# EAGLE schematic cryologger_itb_v1 (EAGLE 9.2.2)

## Sheet 1 of 3
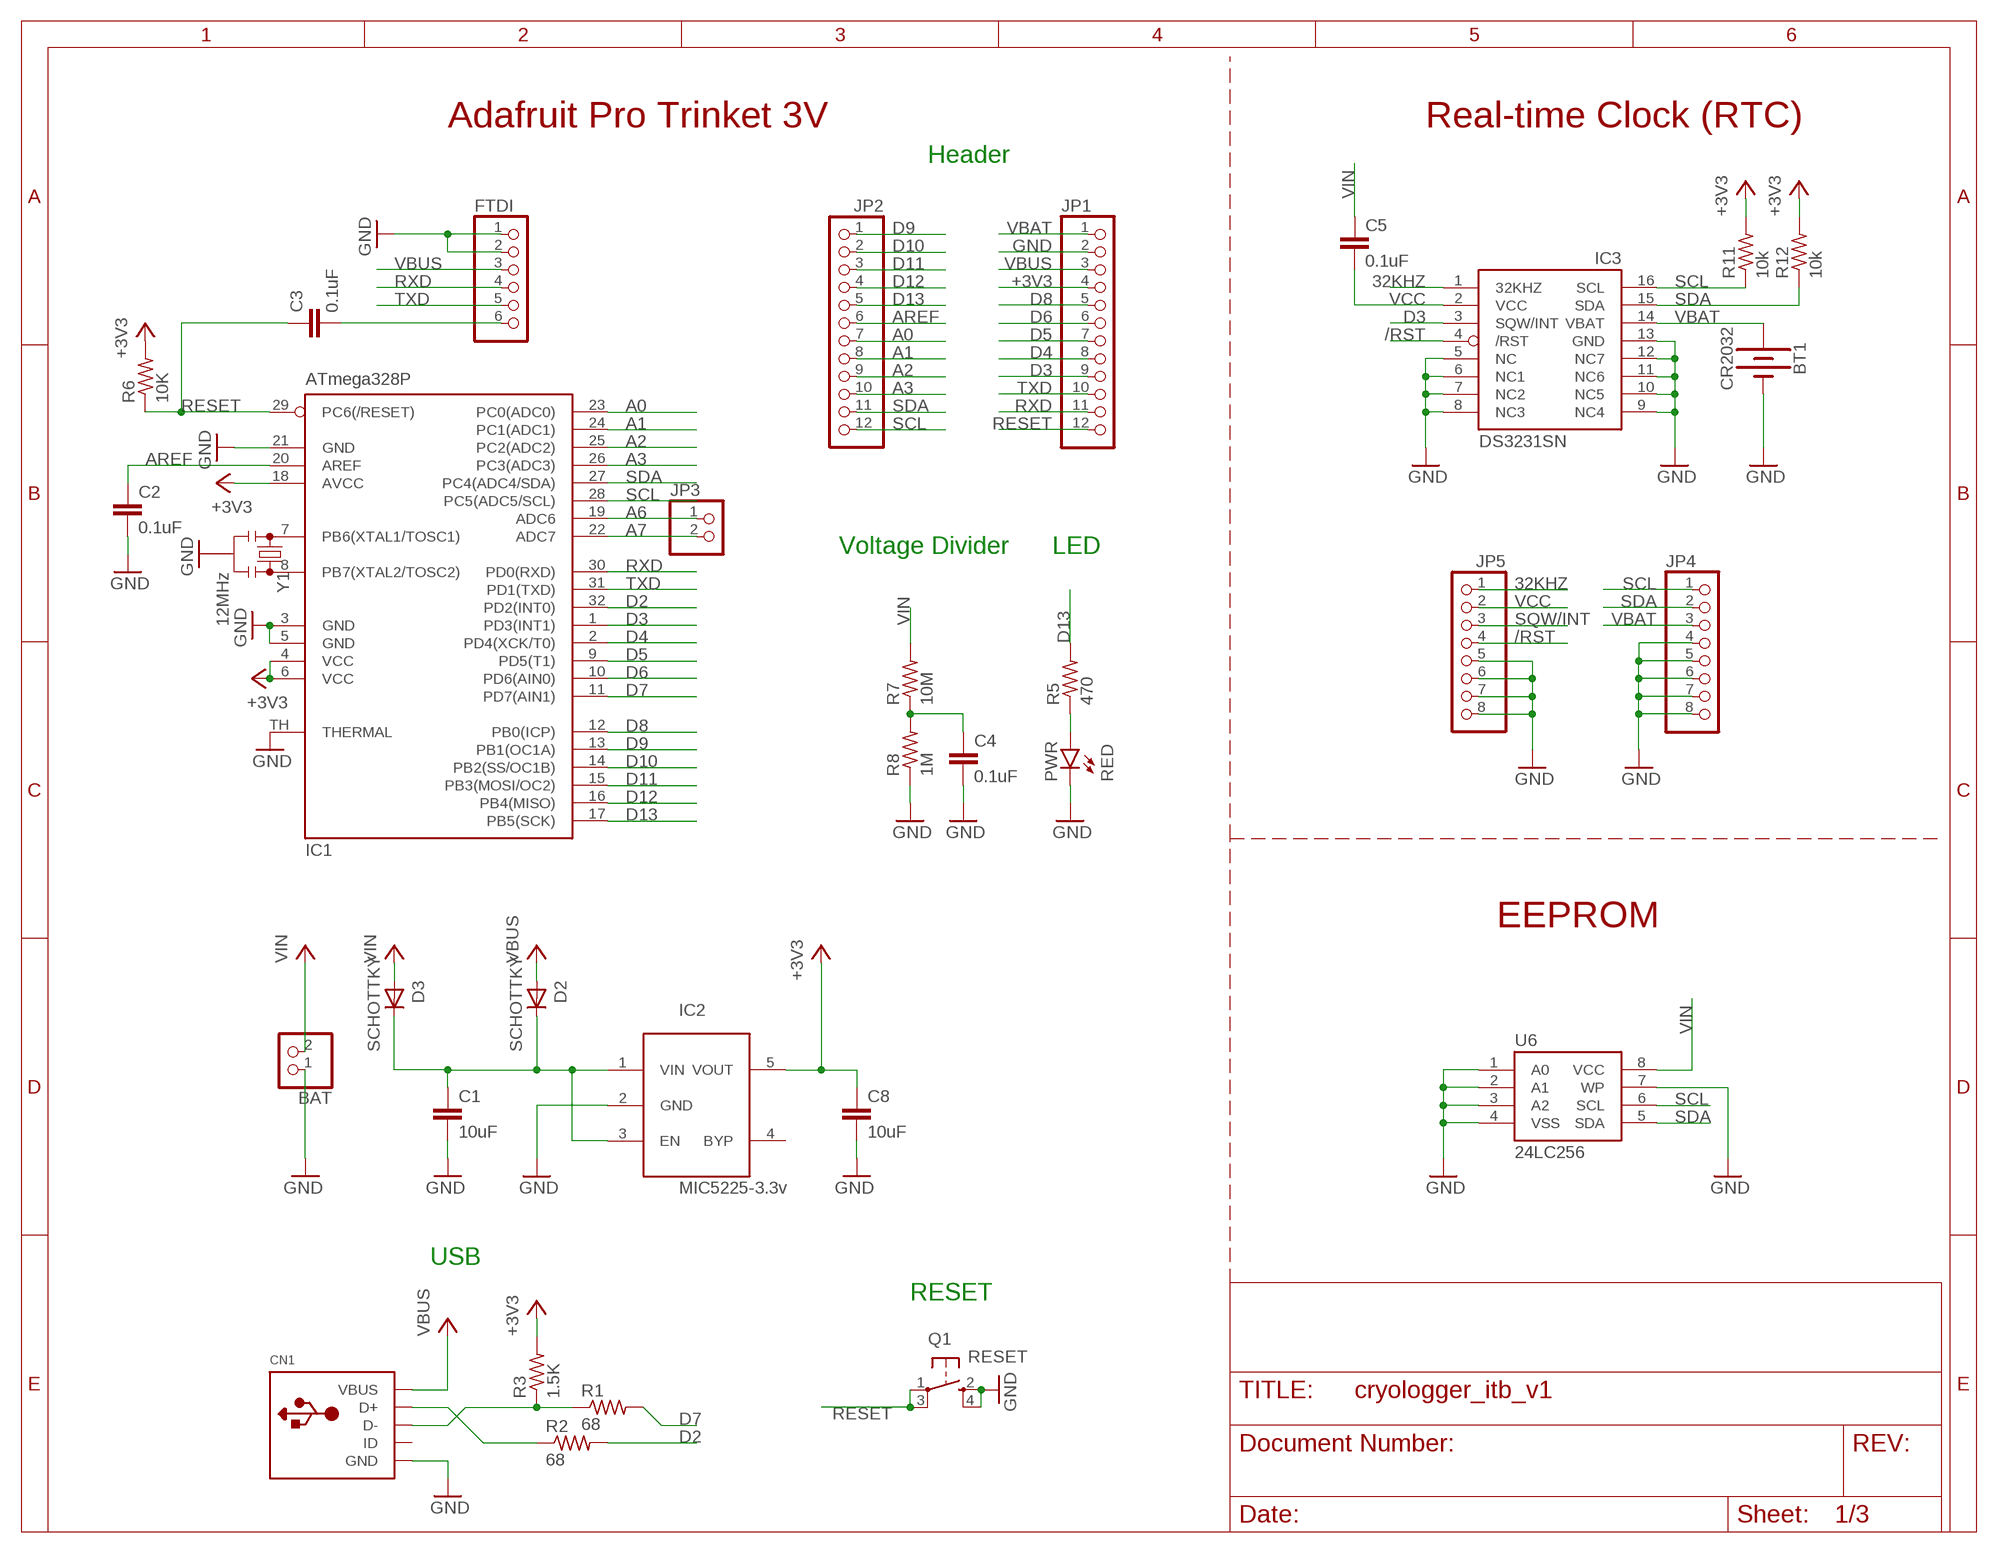
[diagram p0: schematic, sheet 1]

### Parts
BAT  PINHD-1X2  [1X02]
BT1  CR2032  BATTERY-20MM_SMD  [BATTCON_20MM]
C1  10uF  C-EUC0805  [C0805]
C2  0.1uF  C-EUC0805  [C0805]
C3  0.1uF  C-EUC0805  [C0805]
C4  0.1uF  C-EU025-024X044  [C025-024X044]
C5  0.1uF  C-EU025-024X044  [C025-024X044]
C8  10uF  C-EUC0805  [C0805]
CN1  USBMICRO_20329  [4UCONN_20329]
D2  SCHOTTKY  DIODE_SOD-123FL  [SOD-123FL]
D3  SCHOTTKY  DIODE_SOD-123FL  [SOD-123FL]
FTDI  PINHD-1X6  [1X06]
IC1  ATmega328P  MEGA8-MI  [MLF32-TH]
IC2  MIC5225-3.3v  LP298XS  [SOT23-5L]
IC3  DS3231SN  DS3231/SO  [SO16W]
JP1  PINHD-1X12  [1X12]
JP2  PINHD-1X12  [1X12]
JP3  PINHD-1X2  [1X02]
JP4  PINHD-1X8  [1X08]
JP5  PINHD-1X8  [1X08]
PWR  RED  LEDSML0805  [SML0805]
Q1  RESET  SPST_TACT-KMR2  [KMR2]
R1  68  R-US_R0603  [R0603]
R2  68  R-US_R0603  [R0603]
R3  1.5K  R-US_R0603  [R0603]
R5  470  R-US_R0603  [R0603]
R6  10K  R-US_R0603  [R0603]
R7  10M  R-US_0207/10  [0207/10]
R8  1M  R-US_0207/10  [0207/10]
R11  10k  R-US_0207/7  [0207/7]
R12  10k  R-US_0207/7  [0207/7]
U6  24LC256  EEPROM-I2CSMD  [SO08]
Y1  12MHz  RESONATOR-8MHZSMD_3.2X1.3  [RESONATOR-SMD-3.2X1.3]

### Nets
32KHZ: IC3.1(32KHZ) JP5.1
+3V3 [power]: C8.1 IC1.4(VCC) IC1.6(VCC) IC1.18(AVCC) IC2.5(VOUT) JP1.4 R3.2 R6.2 R11.2 R12.2 ; also sheet 2
/RST: IC3.4(/RST) JP5.4
A0: IC1.23(PC0(ADC0)) JP2.7
A1: IC1.24(PC1(ADC1)) JP2.8
A2: IC1.25(PC2(ADC2)) JP2.9
A3: IC1.26(PC3(ADC3)) JP2.10
A6: IC1.19(ADC6) JP3.1
A7: IC1.22(ADC7) JP3.2
AREF: C2.1 IC1.20(AREF) JP2.6
D2: IC1.32(PD2(INT0)) R2.2
D3: IC1.1(PD3(INT1)) IC3.3(SQW/INT) JP1.9
D4: IC1.2(PD4(XCK/T0)) JP1.8
D5: IC1.9(PD5(T1)) JP1.7
D6: IC1.10(PD6(AIN0)) JP1.6
D7: IC1.11(PD7(AIN1)) R1.2
D8: IC1.12(PB0(ICP)) JP1.5
D9: IC1.13(PB1(OC1A)) JP2.1
D10: IC1.14(PB2(SS/OC1B)) JP2.2
D11: IC1.15(PB3(MOSI/OC2)) JP2.3
D12: IC1.16(PB4(MISO)) JP2.4
D13: IC1.17(PB5(SCK)) JP2.5 R5.2
D+: CN1.D+ R2.1
D-: CN1.D- R1.1 R3.1
DTR/RTS: C3.2 FTDI.6
GND [power]: BAT.1 BT1.2(-) C1.2 C2.2 C4.2 C8.2 CN1.BASE@1(GND) CN1.BASE@2(GND) CN1.GND CN1.SPRT@1(GND) CN1.SPRT@2(GND) CN1.SPRT@3(GND) CN1.SPRT@4(GND) FTDI.1 FTDI.2 IC1.3(GND) IC1.5(GND) IC1.21(GND) IC1.TH(THERMAL) IC2.2(GND) IC3.5(NC) IC3.6(NC1) IC3.7(NC2) IC3.8(NC3) IC3.9(NC4) IC3.10(NC5) IC3.11(NC6) IC3.12(NC7) IC3.13(GND) JP1.2 JP4.4 JP4.5 JP4.6 JP4.7 JP4.8 JP5.5 JP5.6 JP5.7 JP5.8 PWR.C Q1.2(S) Q1.4(S1) R8.1 U6.1(A0) U6.2(A1) U6.3(A2) U6.4(VSS) U6.7(WP) Y1.2 ; also sheet 2,3
N$1: PWR.A R5.1
N$2: IC1.8(PB7(XTAL2/TOSC2)) Y1.3
N$3: IC1.7(PB6(XTAL1/TOSC1)) Y1.1 ; also sheet 2
N$4: C1.1 D2.C D3.C IC2.1(VIN) IC2.3(EN)
N$5: C4.1 R7.1 R8.2
RESET: C3.1 IC1.29(PC6(/RESET)) JP1.12 Q1.1(P) Q1.3(P1) R6.1
RXD: FTDI.4 IC1.30(PD0(RXD)) JP1.11
SCL: IC1.28(PC5(ADC5/SCL)) IC3.16(SCL) JP2.12 JP4.1 R11.1 U6.6(SCL) ; also sheet 2
SDA: IC1.27(PC4(ADC4/SDA)) IC3.15(SDA) JP2.11 JP4.2 R12.1 U6.5(SDA) ; also sheet 2
SQW/INT: JP5.3
TXD: FTDI.5 IC1.31(PD1(TXD)) JP1.10
VBAT [power]: BAT.2 BT1.1(+) D3.A IC3.14(VBAT) JP1.1 JP4.3 ; supply symbol labelled VIN
VBUS [power]: D2.A FTDI.3 JP1.3
VCC: C5.2 CN1.VBUS IC3.2(VCC) JP5.2 ; supply symbol labelled VBUS
VIN: C5.1 R7.2 U6.8(VCC) ; also sheet 2
Unconnected: CN1.ID IC2.4(BYP)

### Notes on the sheet
- Adafruit Pro Trinket 3V | Real-time Clock (RTC)
- Header
- Voltage Divider | LED
- EEPROM
- USB
- RESET

## Sheet 2 of 3
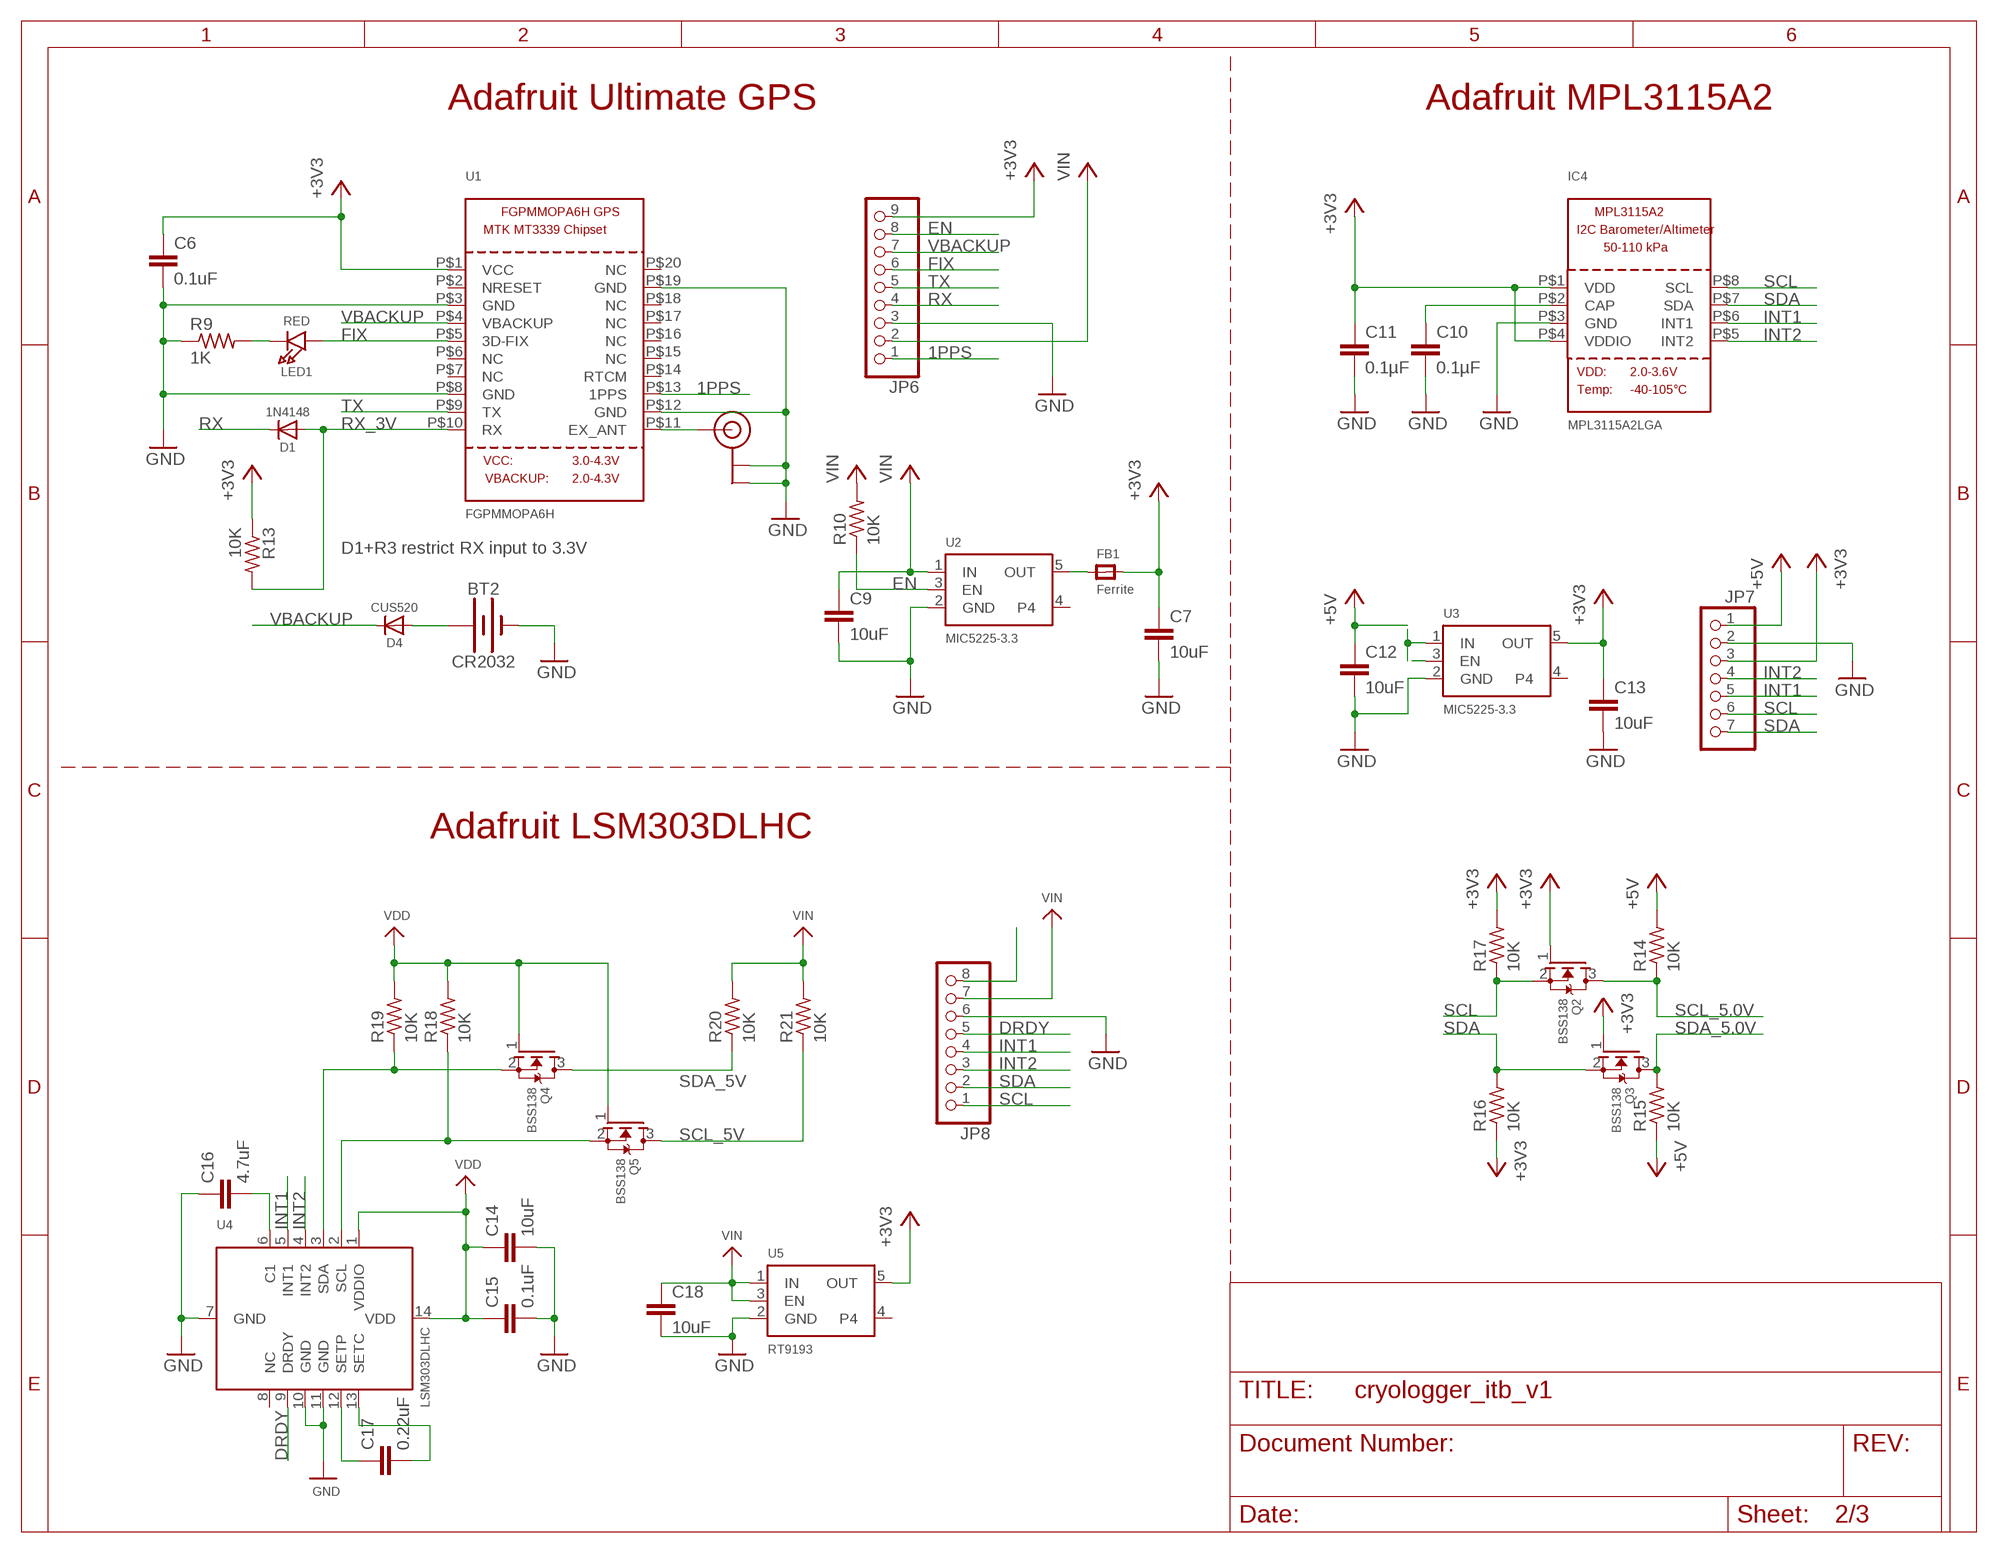
[diagram p1: schematic, sheet 2]

### Parts
BT2  CR2032  BATTERY-20MM_SMD  [BATTCON_20MM]
C6  0.1uF  C-EUC0805  [C0805]
C7  10uF  C-EUC0805  [C0805]
C9  10uF  C-EUC0805  [C0805]
C10  0.1µF  C-EUC0805  [C0805]
C11  0.1µF  C-EUC0805  [C0805]
C12  10uF  C-EUC0805  [C0805]
C13  10uF  C-EUC0805  [C0805]
C14  10uF  C-EUC0805  [C0805]
C15  0.1uF  C-EUC0805  [C0805]
C16  4.7uF  C-EUC0805  [C0805]
C17  0.22uF  C-EUC0805  [C0805]
C18  10uF  C-EUC0805  [C0805]
D1  1N4148  DIODESOD-323  [SOD-323]
D4  CUS520  DIODESOD-323  [SOD-323]
FB1  Ferrite  FERRITE-0805NO  [0805-NO@1]
IC4  MPL3115A2LGA  [LGA8]
JP6  HEADER-1X970MIL  [1X09_ROUND_70]
JP7  HEADER-1X770MIL  [1X07_ROUND_70]
JP8  HEADER-1X876MIL  [1X08_ROUND_76]
LED1  RED  LED0805  [CHIPLED_0805]
Q2  BSS138  MOSFET-NWIDE  [SOT23-WIDE]
Q3  BSS138  MOSFET-NWIDE  [SOT23-WIDE]
Q4  BSS138  MOSFET-NWIDE  [SOT23-WIDE]
Q5  BSS138  MOSFET-NWIDE  [SOT23-WIDE]
R9  1K  R-US_R0805  [R0805]
R10  10K  R-US_R0805  [R0805]
R13  10K  R-US_R0805  [R0805]
R14  10K  R-US_R0805  [R0805]
R15  10K  R-US_R0805  [R0805]
R16  10K  R-US_R0805  [R0805]
R17  10K  R-US_R0805  [R0805]
R18  10K  R-US_R0805  [R0805]
R19  10K  R-US_R0805  [R0805]
R20  10K  R-US_R0805  [R0805]
R21  10K  R-US_R0805  [R0805]
U1  FGPMMOPA6H  GPS_FGPMMOPA6H  [FGPMMOPA6H]
U2  MIC5225-3.3  VREG_SOT23-5  [SOT23-5]
U3  MIC5225-3.3  VREG_SOT23-5  [SOT23-5]
U4  LSM303DLHC  [LGA14]
U5  RT9193  VREG_SOT23-5  [SOT23-5]
U$20  U.FL  [U.FL]

### Nets
1PPS: JP6.1 U1.P$13(1PPS)
3.3V: C6.1 JP6.9 R13.1 U1.P$1(VCC) ; supply symbol labelled +3V3
+3V3 [power]: C7.1 C11.1 C13.1 FB1.2 IC4.P$1(VDD) IC4.P$4(VDDIO) JP7.3 Q2.1(G) Q3.1(G) R16.1 R17.2 U3.5(OUT) ; also sheet 1
+5V: C12.1 JP7.1 R14.2 R15.1 U3.1(IN) U3.3(EN)
DRDY: JP8.5 U4.9(DRDY)
EN: JP6.8 R10.1 U2.3(EN)
FIX: JP6.6 LED1.A U1.P$5(3D-FIX)
GND [power]: BT2.2(-) C6.2 C7.2 C9.2 C10.2 C11.2 C12.2 C13.2 C14.2 C15.2 C16.1 C18.2 IC4.P$3(GND) JP6.3 JP7.2 JP8.6 R9.1 U1.P$3(GND) U1.P$8(GND) U1.P$12(GND) U1.P$19(GND) U2.2(GND) U3.2(GND) U4.7(GND) U4.10(GND) U4.11(GND) U5.2(GND) U$20.P$1(GND) U$20.P$2(GND) ; also sheet 1,3
INT1: IC4.P$6(INT1) JP7.5 JP8.4 U4.5(INT1)
INT2: IC4.P$5(INT2) JP7.4 JP8.3 U4.4(INT2)
N$3: FB1.1 U2.5(OUT) ; also sheet 1
N$7: LED1.C R9.2
N$8: U1.P$11(EX_ANT) U$20.P$3(SIGNAL)
N$9: BT2.1(+) D4.A
N$10: C10.1 IC4.P$2(CAP)
N$11: C16.2 U4.6(C1)
N$12: C17.1 U4.12(SETP)
N$13: C17.2 U4.13(SETC)
N$14: Q4.2(S) R19.1 U4.3(SDA)
N$15: Q5.2(S) R18.1 U4.2(SCL)
RX: D1.C JP6.4
RX_3V: D1.A R13.2 U1.P$10(RX)
SCL: IC4.P$8(SCL) JP7.6 JP8.1 Q2.2(S) R17.1 ; also sheet 1
SCL_5.0V: Q2.3(D) R14.1
SCL_5V: Q5.3(D) R21.1
SDA: IC4.P$7(SDA) JP7.7 JP8.2 Q3.2(S) R16.2 ; also sheet 1
SDA_5.0V: Q3.3(D) R15.2
SDA_5V: Q4.3(D) R20.1
TX: JP6.5 U1.P$9(TX)
VBACKUP: D4.C JP6.7 U1.P$4(VBACKUP)
VDD: C14.1 C15.1 JP8.8 Q4.1(G) Q5.1(G) R18.2 R19.2 U4.1(VDDIO) U4.14(VDD) U5.5(OUT) ; supply symbol labelled +3V3
VIN: C9.1 C18.1 JP6.2 JP8.7 R10.2 R20.2 R21.2 U2.1(IN) U5.1(IN) U5.3(EN) ; also sheet 1
Unconnected: U1.P$2(NRESET) U1.P$6(NC) U1.P$7(NC) U1.P$14(RTCM) U1.P$15(NC) U1.P$16(NC) U1.P$17(NC) U1.P$18(NC) U1.P$20(NC) U2.4 U3.4 U4.8(NC) U5.4

### Notes on the sheet
- Adafruit Ultimate GPS | Adafruit MPL3115A2
- D1+R3 restrict RX input to 3.3V
- Adafruit LSM303DLHC

## Sheet 3 of 3
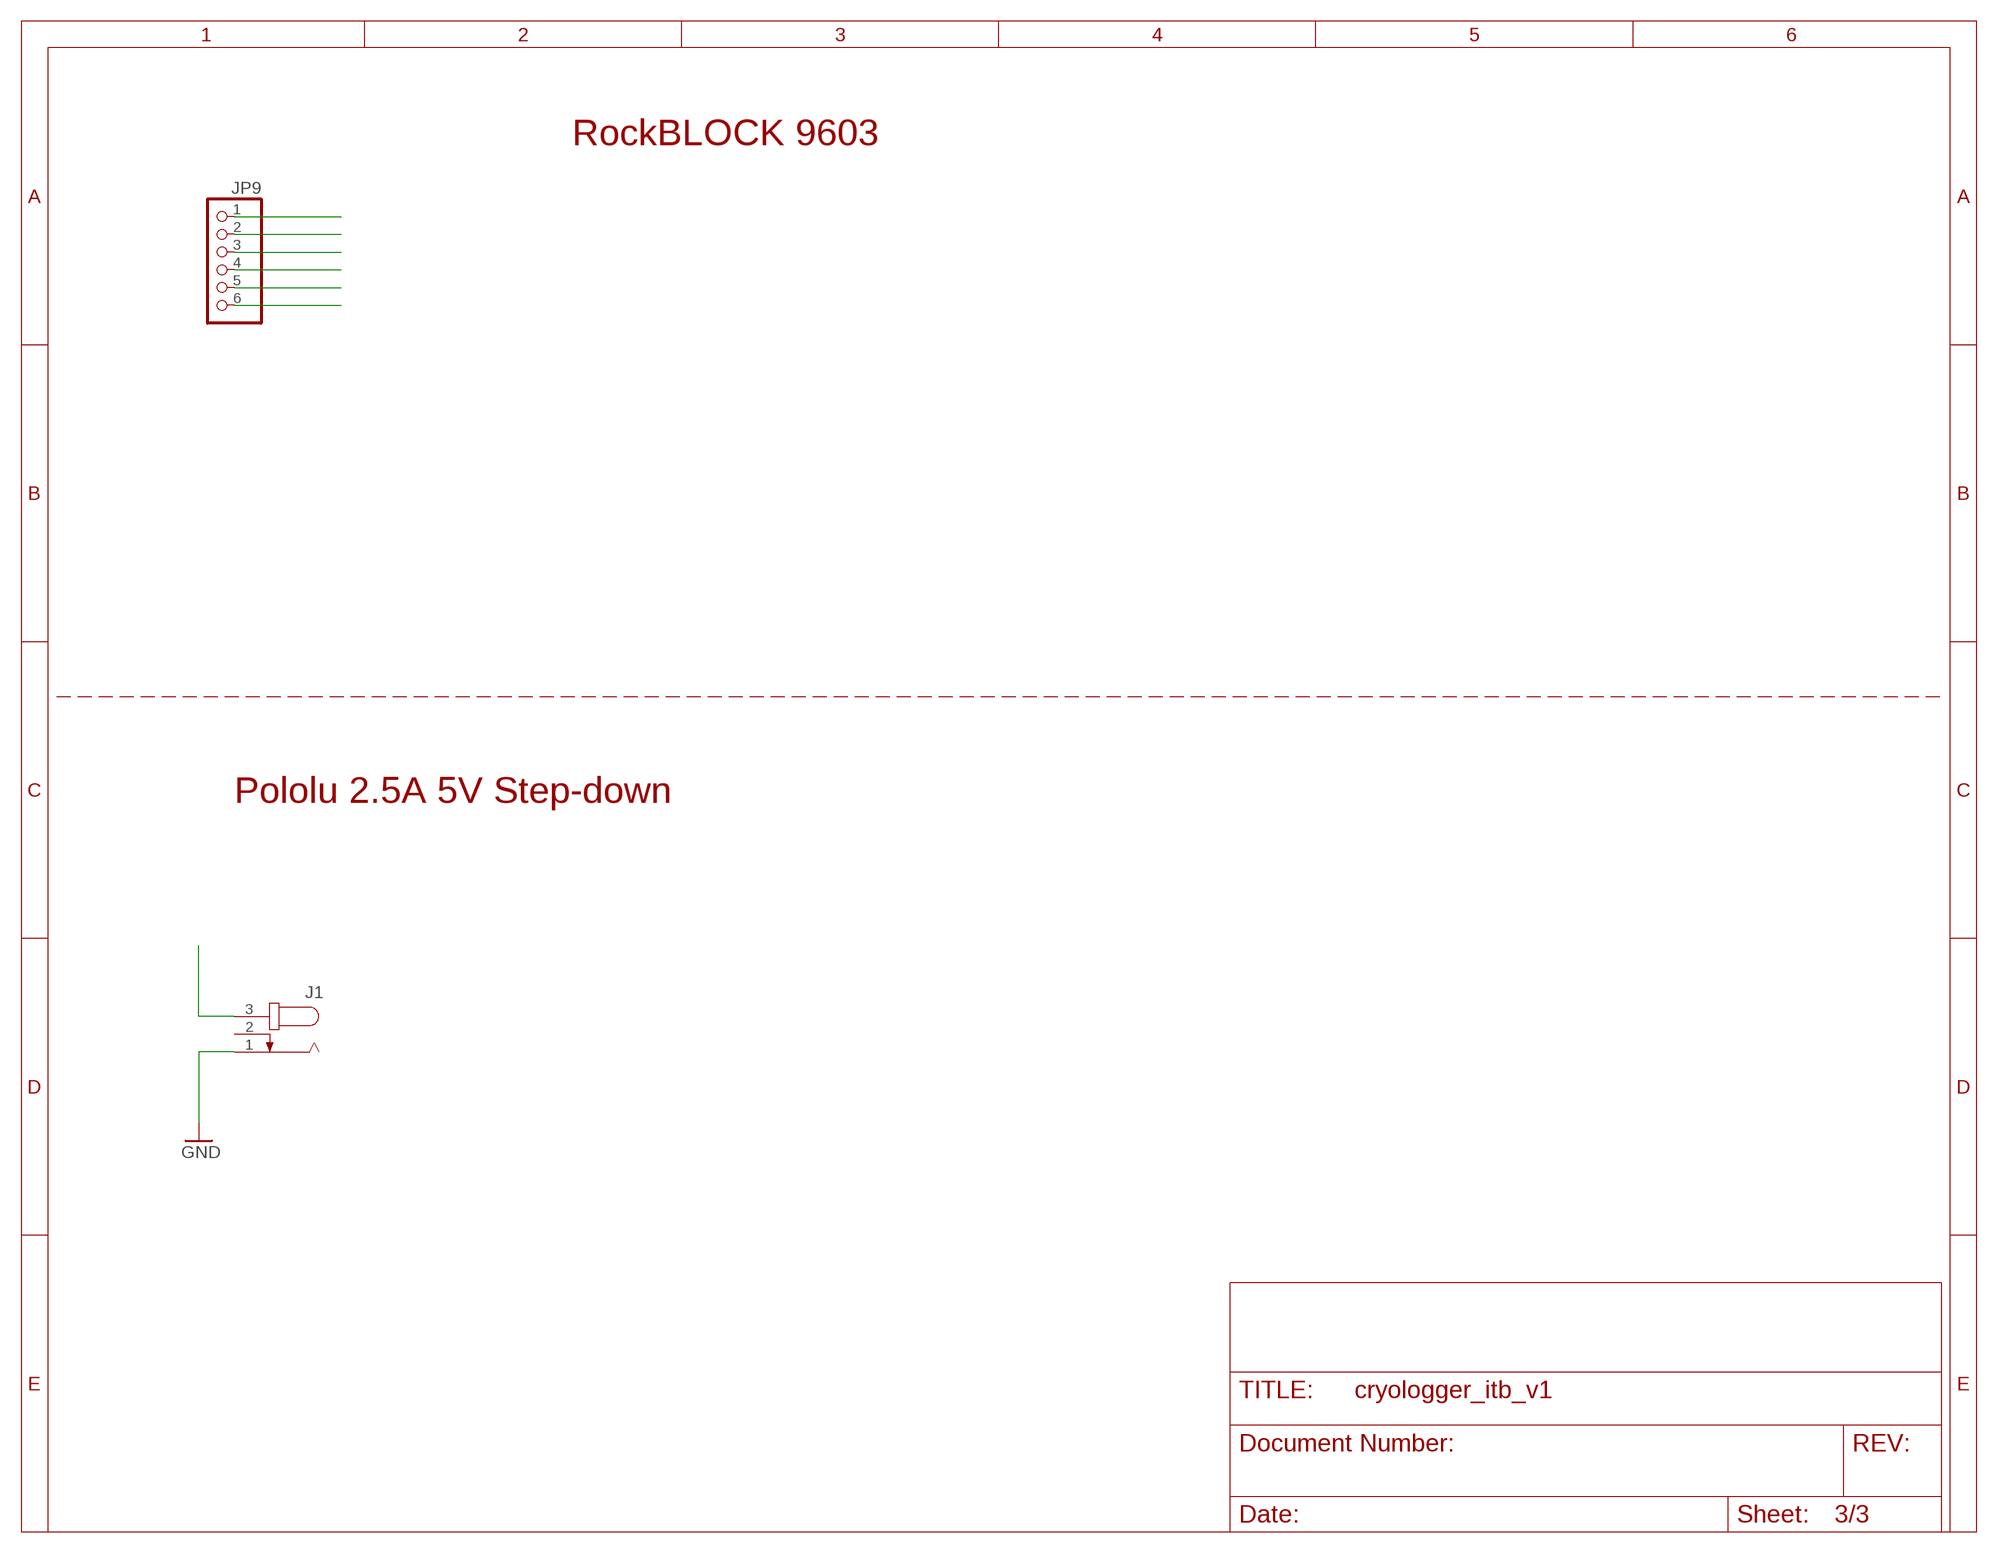
[diagram p2: schematic, sheet 3]

### Parts
J1  JACK-PLUG0  [SPC4077]
JP9  PINHD-1X6  [1X06]

### Nets
GND [power]: J1.1 ; also sheet 1,2
N$6: JP9.1
N$16: JP9.2
N$17: JP9.3
N$18: JP9.4
N$19: JP9.5
N$20: JP9.6
N$22: J1.3
Unconnected: J1.2

### Notes on the sheet
- RockBLOCK 9603
- Pololu 2.5A 5V Step-down

## Library data of the parts
BAT JP3 = pinhead:PINHD-1X2: PIN HEADER
BT1 BT2 = SparkFun-Batteries:BATTERY: Battery - Single Cell A variety of battery chemistries, sizes, and footprints. Device List: 20MM_PTH - Coin Cell Battery Holder - 20mm (PTH) <https://www.sparkfun.com/products/783> 6.8MM_PTH - Coin Cell Battery Holder - 6.8MM(SMD) <https://www.digikey.com/product-detail/en/seiko-instruments/MS621FE-FL11E/728-1057-ND/1889208?WT.srch=1&gclid=CNOQ5a6LzdQCFZS2wAodXCkE0g> 12MM_SMD - Coin Cell Battery Holder - 12mm (SMD) <https://www.sparkfun.com/products/10592> 12MM_PTH - Coin Cell Battery Holder - 12mm (PTH) <https://www.sparkfun.com/products/7948> 20MM_SMD - 20mm Coin Cell Battery Holder (SMD) (2 legs) Used on the Big Time Watch Kit <https://www.sparkfun.com/products/11734> 20MM_SMD_4LEGS - Coin Cell Battery Holder - 20mm (SMD) <https://www.sparkfun.com/products/11892> 20MM_SMD_4LEGS_OVERPASTE - Coin Cell Battery Holder - 20mm (SMD) <https://www.sparkfun.com/products/11892> (Over-paste on the legs) 24.5MM_PTH - Coin Cell Battery Holder - 24.5mm (PTH) <https://www.sparkfun.com/products/8863> 9V - 9V Battery Holder - PC Mount Used on the SparkFun SparkPunk Sound Kit <https://www.sparkfun.com/products/11177> and SparkFun SparkPunk Sequencer Kit <https://www.sparkfun.com/products/12707> 18650 - Battery Holder - 18650 (PTH) <https://www.sparkfun.com/products/13113> AA - Battery Holder - 1xAA (PTH) <https://www.sparkfun.com/products/7949> AAA - Battery Holder - 1xAAA (PTH) <https://www.sparkfun.com/products/12718> AA_KIT - Battery Holder - 1xAA (PTH) <https://www.sparkfun.com/products/7949> Special kit package - pads only have exposed copper on one side of the board. AAA_KIT - Battery Holder - 1xAAA (PTH) <https://www.sparkfun.com/products/12718> Special kit package - pads only have exposed copper on one side of the board.; PROD_ID: BATT-11519
C1-C18 = rcl:C-EU: CAPACITOR, European symbol; SPICEPREFIX: C
CN1 = microbuilder:USB: USB Connectors USBMINIB - Surface Mount Female Mini-B USB Connector 4UConnector: 06564
D1 D4 = microbuilder:DIODE: Diode
D2 D3 = adafruit:DIODE: Diode
FB1 = microbuilder:FERRITE: Ferrite Bead 0603 MMZ1608B121C - 120 Ohm @ 100MHz, 600mA, 0.15 Ohm DC Resistance - Digikey: 445-2164-1-ND BK1608HW121-T - 120 Ohm, 600mA Ferrite Chip - Digikey: 587-1876-2-ND 0805 HZ0805B272R-10 - 2.7K Ohm @ 100MHz, 200mA, 0.8 Ohm DC Resistance - Digikey: 240-2504-1-ND (see also Murata BLM21BD272SN1L) MMZ2012Y152B - 1.5K Ohm @ 100MHz, 500mA, 0.4 Ohm DC Resistance - Digikey: 445-1560-1-ND - Mainly for high frequency (80-400MHz) MMZ2012R102A - 1K Ohm @ 100MHz, 500mA, 0.3 Ohm DC Resistance - Digikey: 445-1555-2-ND - More general purpose (10-200MHz)
FTDI JP9 = pinhead:PINHD-1X6: PIN HEADER
IC1 = microbuilder:MEGA8-MI: MICROCONTROLLER 8 Kbytes FLASH, 1 kbytes SRAM, 512 bytes EEPROM, USART, 6-channel 10 bit ADC, 2-channel 8 bit ADC Pin compatible with Atmega48, ATMega88, ATMega168 Source: avr.lbr; MPN: ATMEGA88PA-MU; OC_FARNELL: 1715491; OC_NEWARK: 15R0272
IC2 = adafruit:LP298X
IC3 = adafruit:DS3231
IC4 = microbuilder:MPL3115A2
J1 = con-jack:JACK-PLUG: DC POWER JACK Power Jack, DC, Right Angle, Through Hole, Rated 5A at 16VDC, PC Terminals Distributor: Farnell (www.Farnell.de) Drawing: 84N1161.pdf / 84N1162.pdf Manufacturer: SPC Technology (www.spctechnology.com) Type: SPC4077 / SPC 4078; OC_FARNELL: unknown; OC_NEWARK: unknown
JP1 JP2 = pinhead:PINHD-1X12: PIN HEADER
JP4 JP5 = pinhead:PINHD-1X8: PIN HEADER
JP6 = microbuilder:HEADER-1X9: PIN HEADER
JP7 = microbuilder:HEADER-1X7: PIN HEADER
JP8 = microbuilder:HEADER-1X8: PIN HEADER
LED1 = microbuilder:LED: LED
PWR = led:LED: LED
Q1 = adafruit:SPST_TACT: SMT 6mm switch, EVQQ2 series http://www.ladyada.net/library/eagle
Q2-Q5 = microbuilder:MOSFET-N: N-Channel Mosfet LEGEND VDS: Voltage Drain-Source ID: Drain Current RDS(ON): Drain-Source On-State Resistance VGS(TH): Gate-Source Threshold Voltage CISS: Drain-Source Input Capacitance SOT-23 Name VDS ID RDS(ON) VGS(TH) CISS Order Number 2N7002E 60V 260mA 2.5 Ohm 2.5V @ 250uA 26.7pF @ 25V 2N7002ET1GOSTR-ND BSH103 30V 850mA 400 mOhm 400mV @ 1mA 83pF @ 24V BSH103,235-ND BSS138 60V 320mA 1.6 Ohm 1.5V @ 250uA 50pF @ 10V Mouser: 771-BSS138PW115 DMN2075U-7 20V 4.2A 38 mOhm 1V @ 250 uA 594.3pF @ 10V DMN2075U-7DICT-ND * BSS138 good choice for I2C level-shifting
R1-R3 R5-R21 = rcl:R-US_: RESISTOR, American symbol; SPICEPREFIX: R
U1 = microbuilder:GPS_FGPMMOPA6H: GPS Module - MTK MT3339 Chipset, -165dBm sensitivity, 22 channels, 10Hz, auto-select external antenna options
U2 U3 U5 = microbuilder:VREG_SOT23-5: SOT23-5 Fixed Voltage Regulators To better organise some of the SOT23-5 fixed voltage regulators in this library, this new part was created. Part Current Out V Out V In V Dropout Digikey Part No. ADP121 150mA 3.3V 3.4-5.5V 0.09V @ 150mA ADP121-AUJZ33R7CT-ND ADP121 150mA 3.0V 3.1-5.5V 0.09V @ 150mA ADP121-AUJZ30R7CT-ND ADP122 300mA 3.3V 3.4-5.5V 0.085V @ 300mA ADP122AUJZ-3.3-R7CT-ND ADP1712 300mA 3.3V 3.5-5.5V 0.17V @ 300mA ADP1712AUJZ-3.3-R7TR-ND AP7311 (Low Cost) 150mA 3.3V 3.5-6V 0.15V @ 150mA AP7311-33WG-7DICT-ND LD39015M18R 150mA 1.8V 1.9V-5.5V 0.08V @ 100mA 497-6977-1-ND MCP1824T-3302E/OT 300mA 3.3V 3.5V-6V 0.2V @ 300mA MCP1824T-3302E/OTCT-ND MIC5205-2.5YM5 TR 150mA 2.5V 2.7-16V 0.165V @ 150mA 576-1257-2-ND MIC5205-3.0YM5 TR 150mA 3.0V 3.2V-16V 0.165V @ 150mA 576-1258-2-ND MIC5205-3.3YM5 TR 150mA 3.3V 3.5V-16V 0.165V @ 150mA 576-1259-2-ND TPS780330220 150mA 3.3V+2.2V 3.6-5.5V 250mV Max 296-23332-1-ND TDA3663/N1,135 100mA 3.3V 3.5-45V 0.18V @ 50mA 568-5343-1-ND
U4 = microbuilder:LSM303DLHC: LSM303DLHC 3-Axis I2C Accelerometer and 3-Axis Magnetometer VDD: 2.2-3.6V VDDIO: 1.8-VDD Magnetic Range: +/-1.3 to +/-8.1 gauss Accel Range: +/-2/4/8/16 g Temp: -40 - 85°C
U6 = SparkFun-IC-Memory:EEPROM-I2C: I2C EEPROMs, 24LC256 and others 24LC256 Series 256 kb I2C 2 Wire (32 k x 8 Bit) 2.5 V Serial EEPROM SMD - SOIC-8 Datasheet SparkFun Products SparkFun UDB5 - PIC UAV Development Board <https://www.sparkfun.com/products/11703> (GPS-11703); PROD_ID: IC-09714
U$20 = microbuilder:U.FL: U.FL Antenna Connector
Y1 = SparkFun-Clocks:RESONATOR-8MHZ: 8MHz Resonator Digikey Example <http://www.digikey.com/product-detail/en/murata-electronics-north-america/CSTCE10M0G55-R0/490-1196-1-ND/584633> Frequency: 8MHz Frequency Stability: ±0.2% Frequency Tolerance: ±0.5% Capacitance: 33pF SparkFun Products Arduino Pro Mini 328- 3.3V/8MHz <https://www.sparkfun.com/products/11114> SparkFun Digital Sandbox <https://www.sparkfun.com/products/12651>; PROD_ID: XTAL-08895; VALUE: 8MHz

## Net classes
1 power: width 0.305 mm